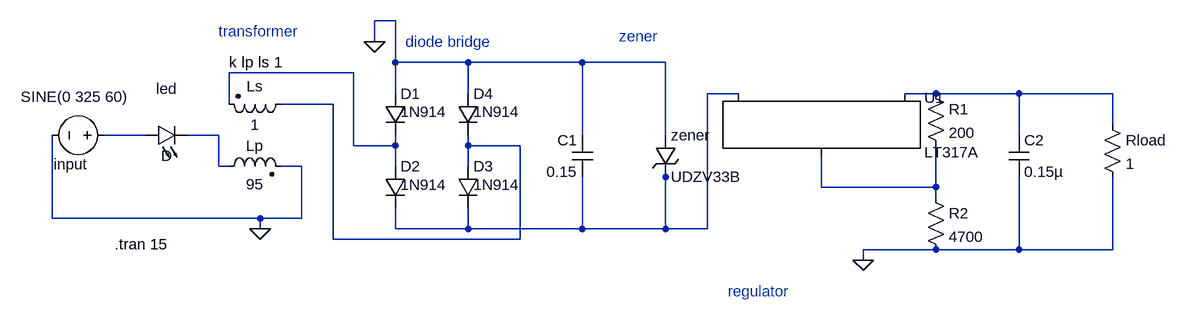
[diagram p0: schematic Semi-Conductor Devices - Variable Power Supply.asc]
Semi-Conductor Devices - Variable Power Supply.asc, the LTspice schematic file:
Version 4
SHEET 1 2716 680
WIRE 240 -160 208 -160
WIRE 208 -128 208 -160
WIRE 240 -96 240 -160
WIRE 352 -96 240 -96
WIRE 528 -96 352 -96
WIRE 656 -96 528 -96
WIRE 176 -80 -16 -80
WIRE 240 -48 240 -96
WIRE 352 -48 352 -96
WIRE 768 -48 720 -48
WIRE 1072 -48 1024 -48
WIRE 1200 -48 1072 -48
WIRE 1344 -48 1200 -48
WIRE -16 -32 -16 -80
WIRE 144 -32 64 -32
WIRE 1344 0 1344 -48
WIRE -144 16 -208 16
WIRE -32 16 -80 16
WIRE 528 16 528 -96
WIRE 656 16 656 -96
WIRE 1200 16 1200 -48
WIRE 176 32 176 -80
WIRE 240 32 240 16
WIRE 240 32 176 32
WIRE 352 32 352 16
WIRE 432 32 352 32
WIRE -32 64 -32 16
WIRE -16 64 -32 64
WIRE 96 64 64 64
WIRE 240 64 240 32
WIRE 352 64 352 32
WIRE 656 80 656 64
WIRE 896 96 896 48
WIRE 1072 96 1072 32
WIRE 1072 96 896 96
WIRE 1072 112 1072 96
WIRE -288 144 -288 16
WIRE 32 144 -288 144
WIRE 96 144 96 64
WIRE 96 144 32 144
WIRE 32 160 32 144
WIRE 240 160 240 128
WIRE 352 160 352 128
WIRE 352 160 240 160
WIRE 528 160 528 80
WIRE 528 160 352 160
WIRE 656 160 656 80
WIRE 656 160 528 160
WIRE 720 160 720 -48
WIRE 720 160 656 160
WIRE 144 176 144 -32
WIRE 432 176 432 32
WIRE 432 176 144 176
WIRE 1072 192 960 192
WIRE 1200 192 1200 80
WIRE 1200 192 1072 192
WIRE 1344 192 1344 80
WIRE 1344 192 1200 192
WIRE 960 208 960 192
FLAG 32 160 0
FLAG 960 208 0
FLAG 208 -128 0
SYMBOL ind2 80 -48 R90
WINDOW 3 32 56 VTop 2
WINDOW 0 4 56 VBottom 2
SYMATTR Value 1
SYMATTR InstName Ls
SYMATTR Type ind
SYMBOL ind2 -32 80 R270
WINDOW 3 4 56 VBottom 2
WINDOW 0 32 56 VTop 2
SYMATTR Value 95
SYMATTR InstName Lp
SYMATTR Type ind
SYMBOL voltage -192 16 R90
WINDOW 3 -59 -22 VRight 2
WINDOW 123 0 0 Left 0
WINDOW 39 -60 131 Left 2
WINDOW 0 45 41 VRight 2
SYMATTR Value SINE(0 325 60)
SYMATTR InstName input
SYMBOL diode 224 -48 R0
WINDOW 3 24 28 Left 2
SYMATTR Value 1N914
SYMATTR InstName D1
SYMBOL diode 224 64 R0
WINDOW 3 24 28 Left 2
SYMATTR Value 1N914
SYMATTR InstName D2
SYMBOL diode 336 64 R0
WINDOW 3 24 28 Left 2
SYMATTR Value 1N914
SYMATTR InstName D3
SYMBOL diode 336 -48 R0
WINDOW 3 24 28 Left 2
SYMATTR Value 1N914
SYMATTR InstName D4
SYMBOL PowerProducts\\LT317A 896 -48 R0
SYMATTR InstName U1
SYMBOL res 1056 -64 R0
SYMATTR InstName R1
SYMATTR Value 200
SYMBOL cap 1184 16 R0
SYMATTR InstName C2
SYMATTR Value 0.15µ
SYMBOL res 1056 96 R0
SYMATTR InstName R2
SYMATTR Value 4700
SYMBOL LED -144 32 R270
WINDOW 0 72 32 VTop 2
WINDOW 3 0 32 VBottom 2
SYMATTR InstName led
SYMBOL cap 544 80 R180
WINDOW 0 24 56 Left 2
WINDOW 3 24 8 Left 2
SYMATTR InstName C1
SYMATTR Value 0.15
SYMBOL zener 640 16 R0
SYMATTR InstName zener
SYMATTR Value UDZV33B
SYMBOL res 1328 -16 R0
SYMATTR InstName Rload
SYMATTR Value 1
TEXT -192 184 Left 2 !.tran 15
TEXT 256 -128 Left 2 ;diode bridge
TEXT -32 -144 Left 2 ;transformer
TEXT 752 256 Left 2 ;regulator
TEXT 584 -136 Left 2 ;zener
TEXT -16 -96 Left 2 !k lp ls 1

The netlist it stands for:
* Semi-Conductor Devices - Variable Power Supply.asc
Ls N004 N001 1
Lp N006 0 95
V§input N005 0 SINE(0 325 60)
D1 0 N001 1N914
D2 N001 N002 1N914
D3 N004 N002 1N914
D4 0 N004 1N914
XU1 N007 N003 N002 LT317A
R1 N003 N007 200
C2 N003 0 0.15µ
R2 N007 0 4700
D§led N005 N006 D
C1 N002 0 0.15
D§zener 0 N002 UDZV33B
Rload N003 0 1
.model D D
.lib standard.dio
.tran 15
* diode bridge
* transformer
* regulator
* zener
k lp ls 1
.lib LTC.lib
.backanno
.end